# Altium schematic sheet cymometer.SchDoc
size A4
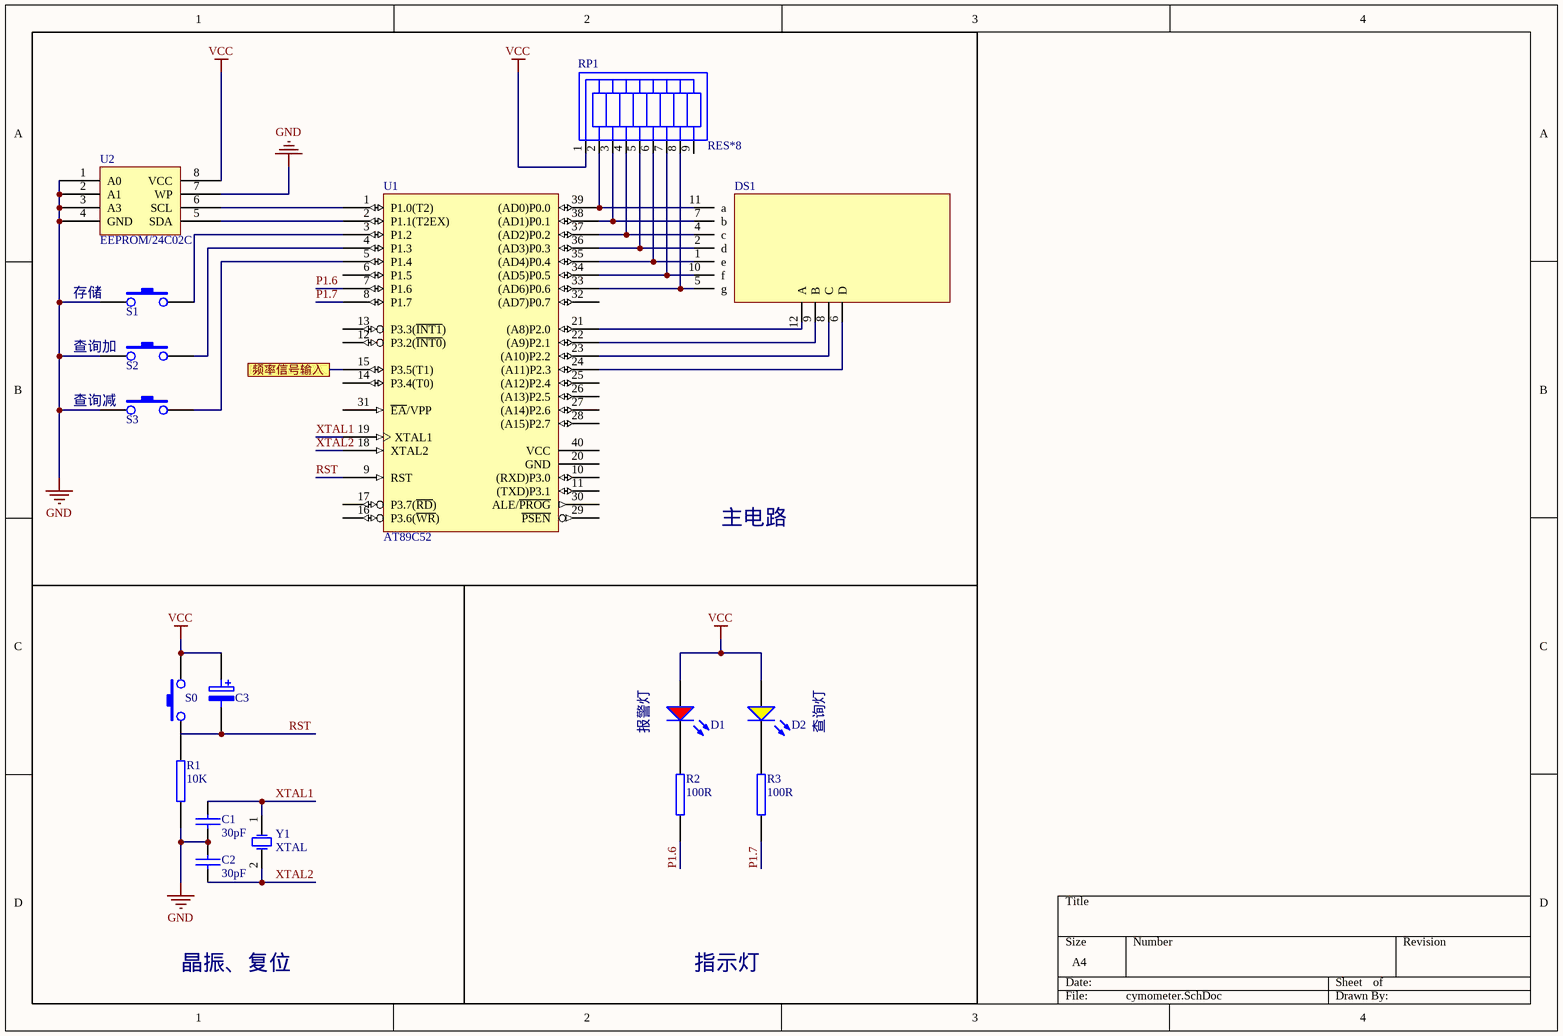
[diagram p0: cymometer.SchDoc]

## Parts
C1  30pF
C2  30pF
C3  ELECTRO2  (value not drawn)
D1  红灯 0805  [LC-0805_LED_S1]  (value not drawn)
D2  黄灯 0805  [LC-0805_LED_S1]  (value not drawn)
DS1  LED  [LED-4 - duplicate]  (value not drawn)
R1  10K
R2  100R
R3  100R
RP1  RES*8  [SIP9]
S0  SW-PB  (value not drawn)
S1  SW-PB  (value not drawn)
S2  SW-PB  (value not drawn)
S3  SW-PB  (value not drawn)
U1  AT89C52  [DIP-40]
U2  EEPROM/24C02C  [LC-SOIC-8_150mil]
Y1  XTAL  [XTAL]

## Ports
频率信号输入

## Nets
GND: C1.2 C2.1 R1.2 S1.2 S2.2 S3.2 U2.1(A0) U2.2(A1) U2.3(A3) U2.4(GND) U2.7(WP)
VCC: C3.1 D1.A D2.A RP1.1 S0.1 U2.8(VCC)
P1.6: R2.2 U1.7(P1.6)
P1.7: R3.2 U1.8(P1.7)
RST: C3.2 R1.1 U1.9(RST)
XTAL1: C1.1 U1.19(XTAL1) Y1.1
XTAL2: C2.2 U1.18(XTAL2) Y1.2
频率信号输入: U1.15(P3.5(T1)) ; port 频率信号输入
NetD1_K: D1.K R2.1
NetD2_K: D2.K R3.1
NetDS1_1: DS1.1(e) RP1.6 U1.35((AD4)P0.4)
NetDS1_2: DS1.2(d) RP1.5 U1.36((AD3)P0.3)
NetDS1_4: DS1.4(c) RP1.4 U1.37((AD2)P0.2)
NetDS1_5: DS1.5(g) RP1.8 U1.33((AD6)P0.6)
NetDS1_6: DS1.6(D) U1.24((A11)P2.3)
NetDS1_7: DS1.7(b) RP1.3 U1.38((AD1)P0.1)
NetDS1_8: DS1.8(C) U1.23((A10)P2.2)
NetDS1_9: DS1.9(B) U1.22((A9)P2.1)
NetDS1_10: DS1.10(f) RP1.7 U1.34((AD5)P0.5)
NetDS1_11: DS1.11(a) RP1.2 U1.39((AD0)P0.0)
NetDS1_12: DS1.12(A) U1.21((A8)P2.0)
NetS1_1: S1.1 U1.3(P1.2)
NetS2_1: S2.1 U1.4(P1.3)
NetS3_1: S3.1 U1.5(P1.4)
NetU1_1: U1.1(P1.0(T2)) U2.6(SCL)
NetU1_2: U1.2(P1.1(T2EX)) U2.5(SDA)

Not connected (* = marked no-connect by the designer): RP1 9; S0 2; U1 6(P1.5) 10((RXD)P3.0) 11((TXD)P3.1) 12(P3.2(~{INT0})) 13(P3.3(~{INT1})) 14(P3.4(T0)) 16(P3.6(~{WR})) 17(P3.7(~{RD})) 20(GND) 25((A12)P2.4) 26((A13)P2.5) 27((A14)P2.6) 28((A15)P2.7) 29(~{PSEN}) 30(ALE/~{PROG}) 31(~{EA}/VPP) 32((AD7)P0.7) 40(VCC)

## Notes on the sheet
- (near S1) 存储
- 查询加
- 查询减
- 主电路
- (near D1) 报警灯
- 查询灯
- 晶振、复位
- 指示灯

## Library data of the parts
C1 C2 = CAP: Capacitor
C3 = ELECTRO2: Electrolytic Capacitor
D1 = 0805 红灯: 发光二极管; ComponentLink1Description: 供应商链接; ComponentLink1URL: http://www.szlcsc.com/product/details_2668.html; Package: 0805; Supplier: LC; SuppliersPartNumber: C2295
D2 = 0805 黄灯: 发光二极管; ComponentLink1Description: 供应商链接; ComponentLink1URL: http://www.szlcsc.com/product/details_2669.html; Package: 0805; Supplier: LC; SuppliersPartNumber: C2296
DS1 = LED-4: DS: LED-4
R1-R3 = RES2
U1 = AT89C52: 8-Bit Microcontroller with 8K Flash ROM
U2 = EEPROM/AT24C256C-SSHL-T: EEPROM; ComponentLink1Description: 供应商链接; ComponentLink1URL: http://www.szlcsc.com/product/details_6947.html; Package: SOIC-8_150mil; Supplier: LC; SuppliersPartNumber: C6482